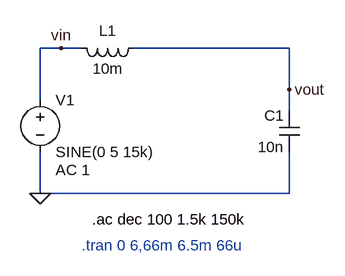
[diagram p0: schematic MARCOS_ANTONIO_TOME_OLIVERA.asc]
MARCOS_ANTONIO_TOME_OLIVERA.asc, the LTspice schematic file:
Version 4.1
SHEET 1 880 680
WIRE 112 32 80 32
WIRE 144 32 112 32
WIRE 464 32 224 32
WIRE 464 96 464 32
WIRE 80 112 80 32
WIRE 464 128 464 96
WIRE 80 256 80 192
WIRE 464 256 464 192
WIRE 464 256 80 256
FLAG 80 256 0
FLAG 464 96 vout
FLAG 112 32 vin
SYMBOL voltage 80 96 R0
WINDOW 123 24 124 Left 2
WINDOW 39 0 0 Left 0
SYMATTR Value2 AC 1
SYMATTR InstName V1
SYMATTR Value SINE(0 5 15k)
SYMBOL ind 240 16 R90
WINDOW 0 5 56 VBottom 2
WINDOW 3 32 56 VTop 2
SYMATTR InstName L1
SYMATTR Value 10m
SYMBOL cap 480 192 R180
WINDOW 0 24 56 Left 2
WINDOW 3 24 8 Left 2
SYMATTR InstName C1
SYMATTR Value 10n
TEXT 144 336 Left 2 ;.tran 0 6,66m 6.5m 66u
TEXT 160 296 Left 2 !.ac dec 100 1.5k 150k

The netlist it stands for:
* MARCOS_ANTONIO_TOME_OLIVERA.asc
V1 vin 0 SINE(0 5 15k) AC 1
L1 vout vin 10m
C1 0 vout 10n
* .tran 0 6,66m 6.5m 66u
.ac dec 100 1.5k 150k
.backanno
.end